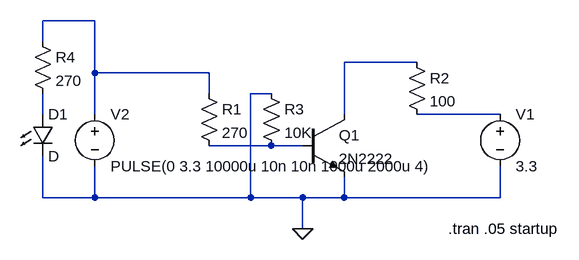
[diagram p0: schematic spektrum.asc]
spektrum.asc, the LTspice schematic file:
Version 4
SHEET 1 880 680
WIRE 48 128 -32 128
WIRE -32 160 -32 128
WIRE 544 192 432 192
WIRE 48 208 48 128
WIRE 224 208 48 208
WIRE 224 240 224 208
WIRE 320 240 288 240
WIRE -32 272 -32 240
WIRE 48 272 48 208
WIRE 432 272 432 192
WIRE 672 272 544 272
WIRE 320 320 224 320
WIRE 368 320 320 320
WIRE -32 400 -32 336
WIRE 48 400 48 352
WIRE 48 400 -32 400
WIRE 288 400 288 240
WIRE 288 400 48 400
WIRE 368 400 288 400
WIRE 432 400 432 368
WIRE 432 400 368 400
WIRE 672 400 672 352
WIRE 672 400 432 400
WIRE 368 448 368 400
FLAG 368 448 0
SYMBOL npn 368 272 R0
SYMATTR InstName Q1
SYMATTR Value 2N2222
SYMBOL res 208 224 R0
SYMATTR InstName R1
SYMATTR Value 270
SYMBOL voltage 672 256 R0
SYMATTR InstName V1
SYMATTR Value 3.3
SYMATTR SpiceLine Rser=0
SYMBOL voltage 48 256 R0
SYMATTR InstName V2
SYMATTR Value PULSE(0 3.3 10000u 10n 10n 1000u 2000u 4)
SYMBOL res 528 176 R0
SYMATTR InstName R2
SYMATTR Value 100
SYMBOL res 304 224 R0
SYMATTR InstName R3
SYMATTR Value 10K
SYMBOL LED -48 272 R0
SYMATTR InstName D1
SYMBOL res -48 144 R0
SYMATTR InstName R4
SYMATTR Value 270
TEXT 592 448 Left 2 !.tran .05 startup

The netlist it stands for:
* spektrum.asc
Q1 N002 N005 0 0 2N2222
R1 N001 N005 270
V1 N004 0 3.3 Rser=0
V2 N001 0 PULSE(0 3.3 10000u 10n 10n 1000u 2000u 4)
R2 N002 N004 100
R3 0 N005 10K
D1 N003 0 D
R4 N001 N003 270
.model D D
.lib standard.dio
.model NPN NPN
.model PNP PNP
.lib standard.bjt
.tran .05 startup
.backanno
.end